# Altium schematic sheet 4_AT_START_F403A_V1.2_Connectors.SchDoc
size A4
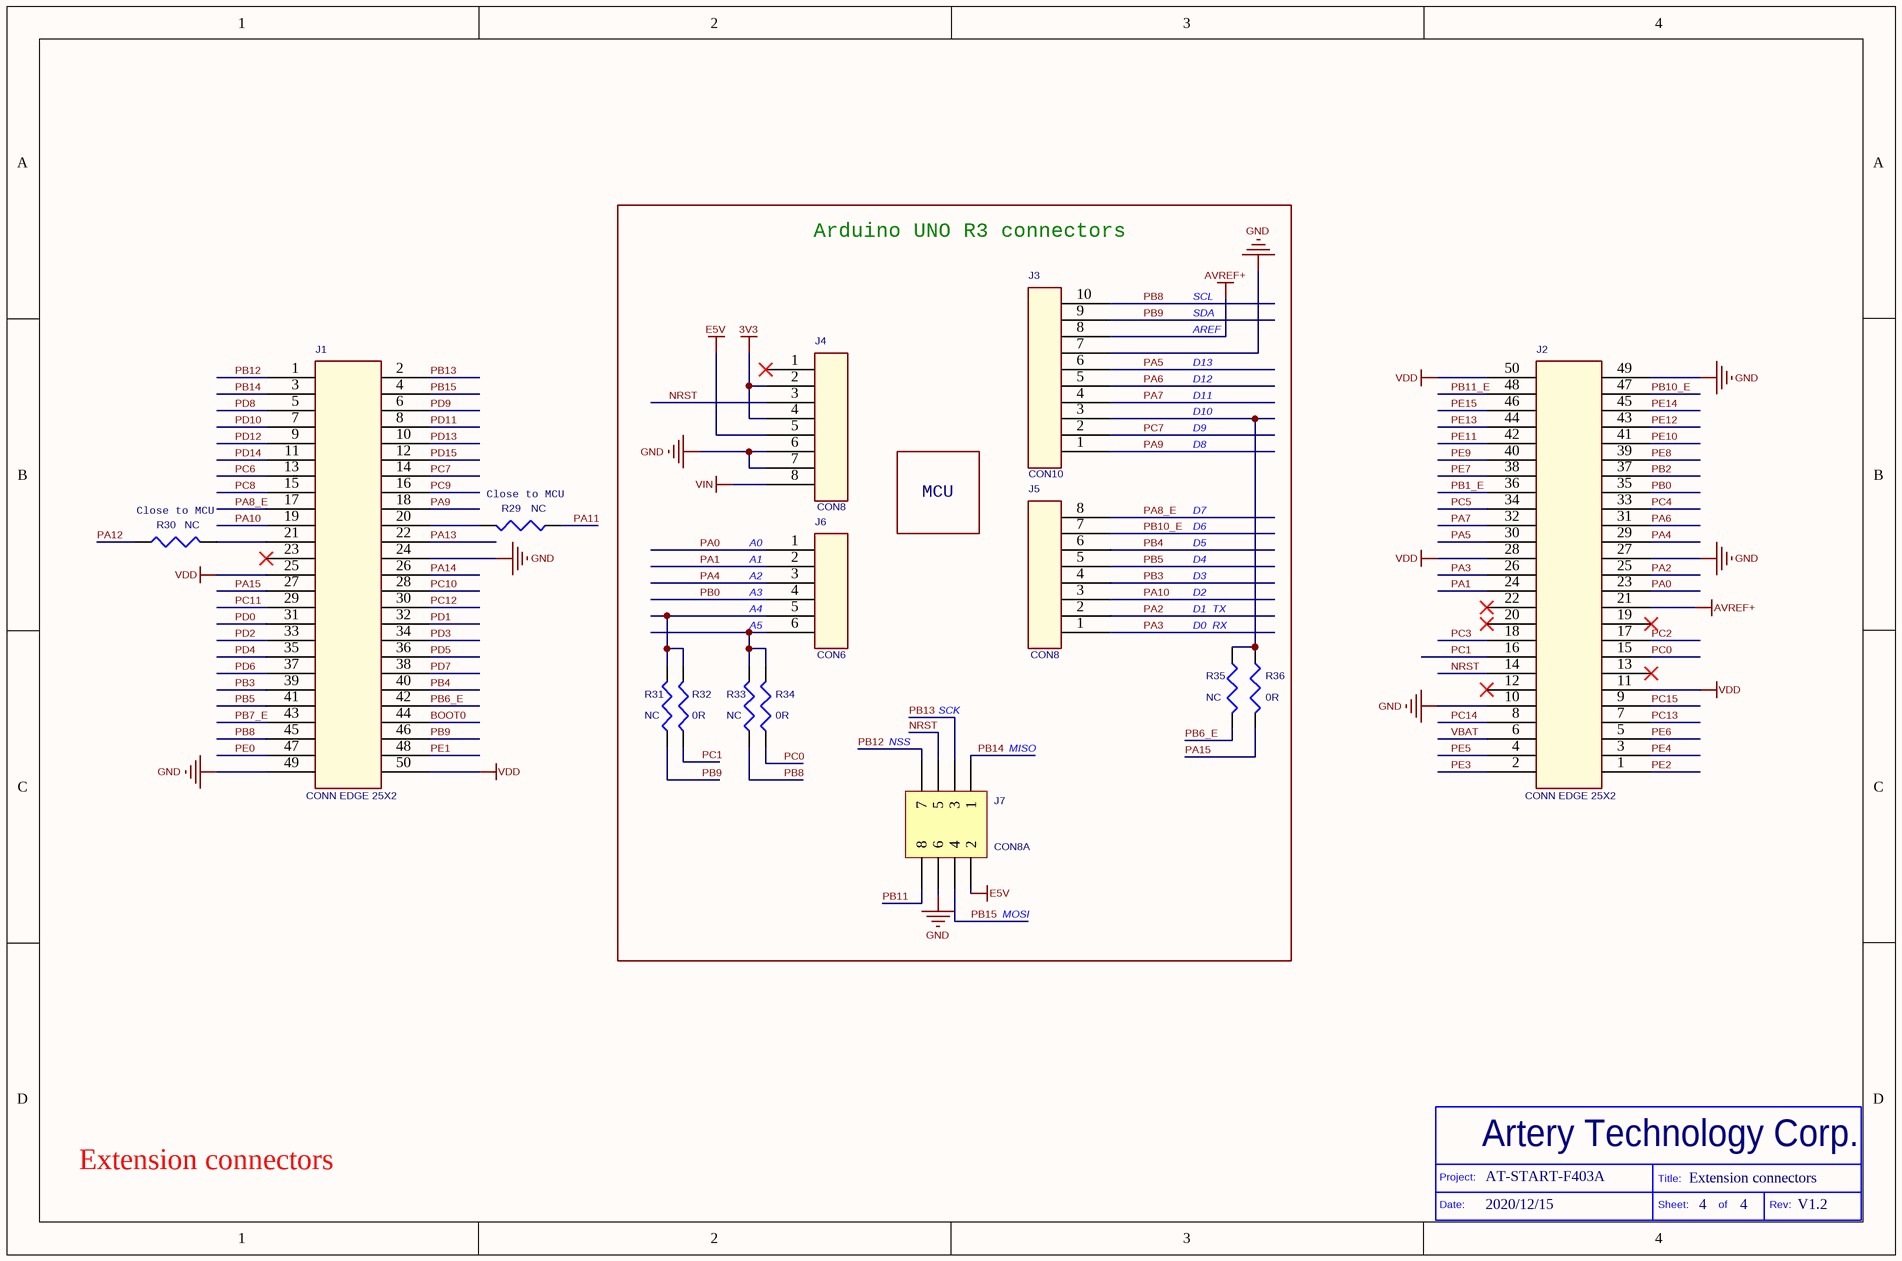
[diagram p0: 4_AT_START_F403A_V1.2_Connectors.SchDoc]

## Parts
J1  CONN EDGE 25X2  [HEAD2*25]
J2  CONN EDGE 25X2  [HEAD2*25]
J3  CON10  [HDR1X10 - 2#]
J4  CON8  [HDR1X8 - 2#]
J5  CON8  [HDR1X8 - 2#]
J6  CON6  [HDR1X6 -2#]
J7  CON8A  [HDR2X4]
R29  NC  [SB-PAD]
R30  NC  [SB-PAD]
R31  NC  [SB-PAD]
R32  0R  [SB-PAD]
R33  NC  [SB-PAD]
R34  0R  [SB-PAD]
R35  NC  [SB-PAD]
R36  0R  [SB-PAD]

## Blocks framed on the sheet
Arduino UNO R3 connectors: J3-J7 R31-R36

## Nets
3V3: J4.2 J4.4
AREF: J2.21 J3.8  [also labelled AVREF+]
E5V: J4.5 J7.2
GND: J1.24 J1.49 J2.10 J2.27 J2.49 J3.7 J4.6 J4.7 J7.6
VDD: J1.25 J1.50 J2.11 J2.28 J2.50
VIN: J4.8
A0: J2.23 J6.1  [also labelled PA0]
A1: J2.24 J6.2  [also labelled PA1]
A2: J2.29 J6.3  [also labelled PA4]
A3: J2.35 J6.4  [also labelled PB0]
A4: J6.5 R31.2 R32.2
A5: J6.6 R33.2 R34.2
BOOT0: J1.44
D0: J2.26 J5.1  [also labelled PA3, RX]
D1: J2.25 J5.2  [also labelled PA2, TX]
D2: J1.19 J5.3  [also labelled PA10]
D3: J1.39 J5.4  [also labelled PB3]
D4: J1.41 J5.5  [also labelled PB5]
D5: J1.40 J5.6  [also labelled PB4]
D6: J2.47 J5.7  [also labelled PB10_E]
D7: J1.17 J5.8  [also labelled PA8_E]
D8: J1.18 J3.1  [also labelled PA9]
D9: J1.14 J3.2  [also labelled PC7]
D10: J3.3 R35.1 R36.1
D11: J2.32 J3.4  [also labelled PA7]
D12: J2.31 J3.5  [also labelled PA6]
D13: J2.30 J3.6  [also labelled PA5]
NRST: J2.14 J4.3 J7.5
PA11: R29.1
PA12: R30.1
PA13: J1.22
PA14: J1.26
PA15: J1.27 R36.2
PB1_E: J2.36
PB2: J2.37
PB6_E: J1.42 R35.2
PB7_E: J1.43
PB8: J1.45 J3.10 R33.1  [also labelled SCL]
PB9: J1.46 J3.9 R31.1  [also labelled SDA]
PB11: J7.8
PB11_E: J2.48
PB12: J1.1 J7.7
PB13: J1.2 J7.3
PB14: J1.3 J7.1
PB15: J1.4 J7.4
PC0: J2.15 R34.1
PC1: J2.16 R32.1
PC2: J2.17
PC3: J2.18
PC4: J2.33
PC5: J2.34
PC6: J1.13
PC8: J1.15
PC9: J1.16
PC10: J1.28
PC11: J1.29
PC12: J1.30
PC13: J2.7
PC14: J2.8
PC15: J2.9
PD0: J1.31
PD1: J1.32
PD2: J1.33
PD3: J1.34
PD4: J1.35
PD5: J1.36
PD6: J1.37
PD7: J1.38
PD8: J1.5
PD9: J1.6
PD10: J1.7
PD11: J1.8
PD12: J1.9
PD13: J1.10
PD14: J1.11
PD15: J1.12
PE0: J1.47
PE1: J1.48
PE2: J2.1
PE3: J2.2
PE4: J2.3
PE5: J2.4
PE6: J2.5
PE7: J2.38
PE8: J2.39
PE9: J2.40
PE10: J2.41
PE11: J2.42
PE12: J2.43
PE13: J2.44
PE14: J2.45
PE15: J2.46
VBAT: J2.6
NetJ1_20: J1.20 R29.2
NetJ1_21: J1.21 R30.2

Not connected (* = marked no-connect by the designer): J1 23*; J2 12* 13* 19* 20* 22*; J4 1*

## Notes on the sheet
- (near R30) Close to MCU
- (near R29) Close to MCU
- MCU
- SCK
- (near J7) NSS
- (near J7) MISO
- (near J7) MOSI
- Extension connectors
- AT-START-F403A
- 2020/12/15
- 4
- V1.2
- Project:
- Date:
- Artery Technology Corp.
- Title:
- Sheet:
- of
- Rev:

## Library data of the parts
J3 = CON10_0
J7 = Header 4X2: Header, 4-Pin, Dual row; LatestRevisionDate: 17-Jul-2002; LatestRevisionNote: Re-released for DXP Platform.; Publisher: Altium Limited
R29 R30 = 470,1/10W,1%,SMD0603
R31-R36 = 10K,1/10W,1%,SMD0603_Dup1